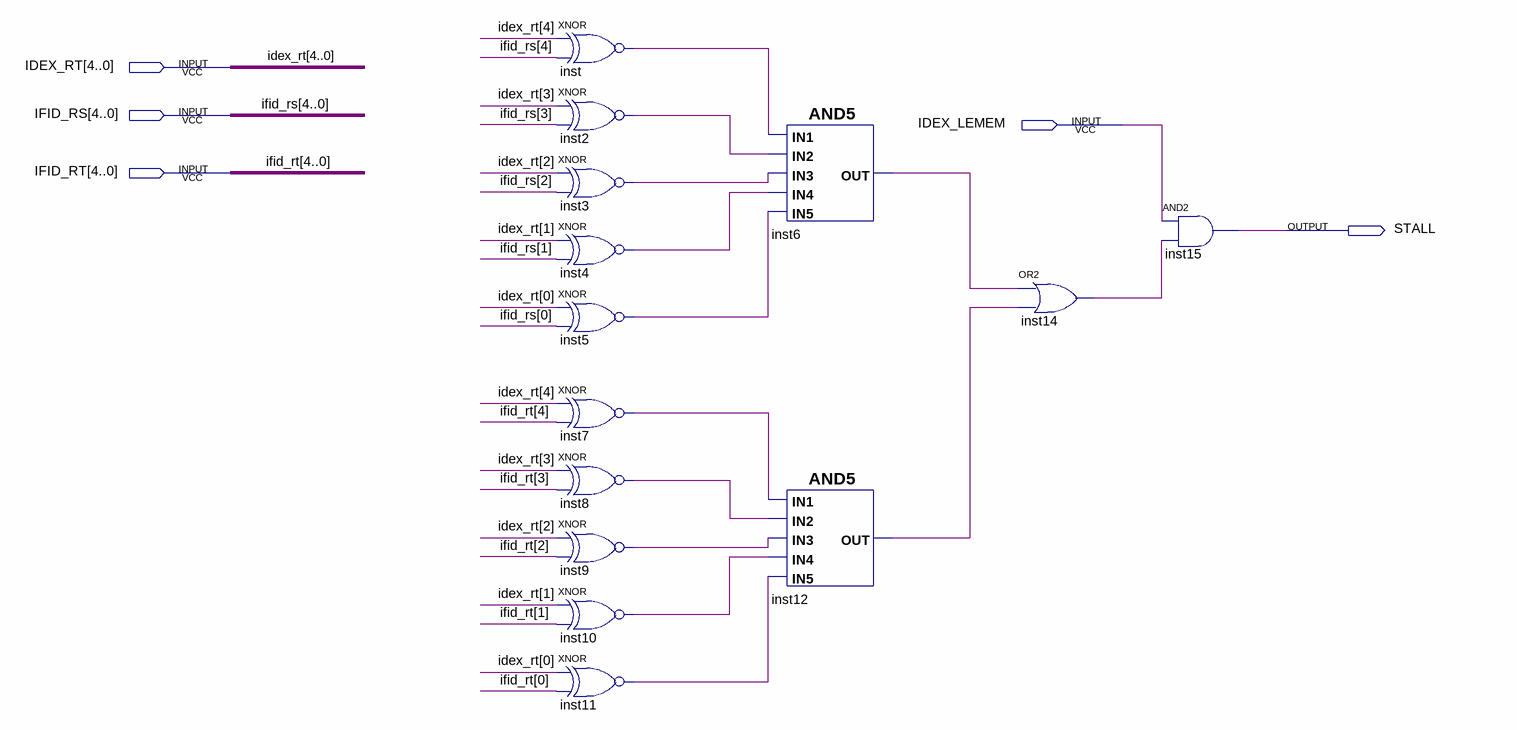
[diagram p0: schematic sheet]
// Quartus schematic unidade_stall.bdf as structural Verilog: 14 symbols, 5 pins
module unidade_stall (
  input  [4:0] IDEX_RT,
  input  [4:0] IFID_RS,
  input  IDEX_LEMEM,
  input  [4:0] IFID_RT,
  output STALL
);

  wire inst2_out, inst3_out, inst4_out, inst5_out, inst6_out, inst7_out, inst8_out, inst9_out, inst10_out,
       inst11_out, inst12_out, inst14_out, inst_out;

  xnor inst (inst_out, IDEX_RT[4], IFID_RS[4]);
  xnor inst2 (inst2_out, IDEX_RT[3], IFID_RS[3]);
  xnor inst3 (inst3_out, IDEX_RT[2], IFID_RS[2]);
  xnor inst4 (inst4_out, IDEX_RT[1], IFID_RS[1]);
  xnor inst5 (inst5_out, IDEX_RT[0], IFID_RS[0]);
  xnor inst7 (inst7_out, IDEX_RT[4], IFID_RT[4]);
  xnor inst8 (inst8_out, IDEX_RT[3], IFID_RT[3]);
  xnor inst9 (inst9_out, IDEX_RT[2], IFID_RT[2]);
  xnor inst10 (inst10_out, IDEX_RT[1], IFID_RT[1]);
  xnor inst11 (inst11_out, IDEX_RT[0], IFID_RT[0]);
  and inst6 (inst6_out, inst_out, inst2_out, inst3_out, inst4_out, inst5_out);
  and inst12 (inst12_out, inst7_out, inst8_out, inst9_out, inst10_out, inst11_out);
  or inst14 (inst14_out, inst6_out, inst12_out);
  and inst15 (STALL, IDEX_LEMEM, inst14_out);
endmodule
